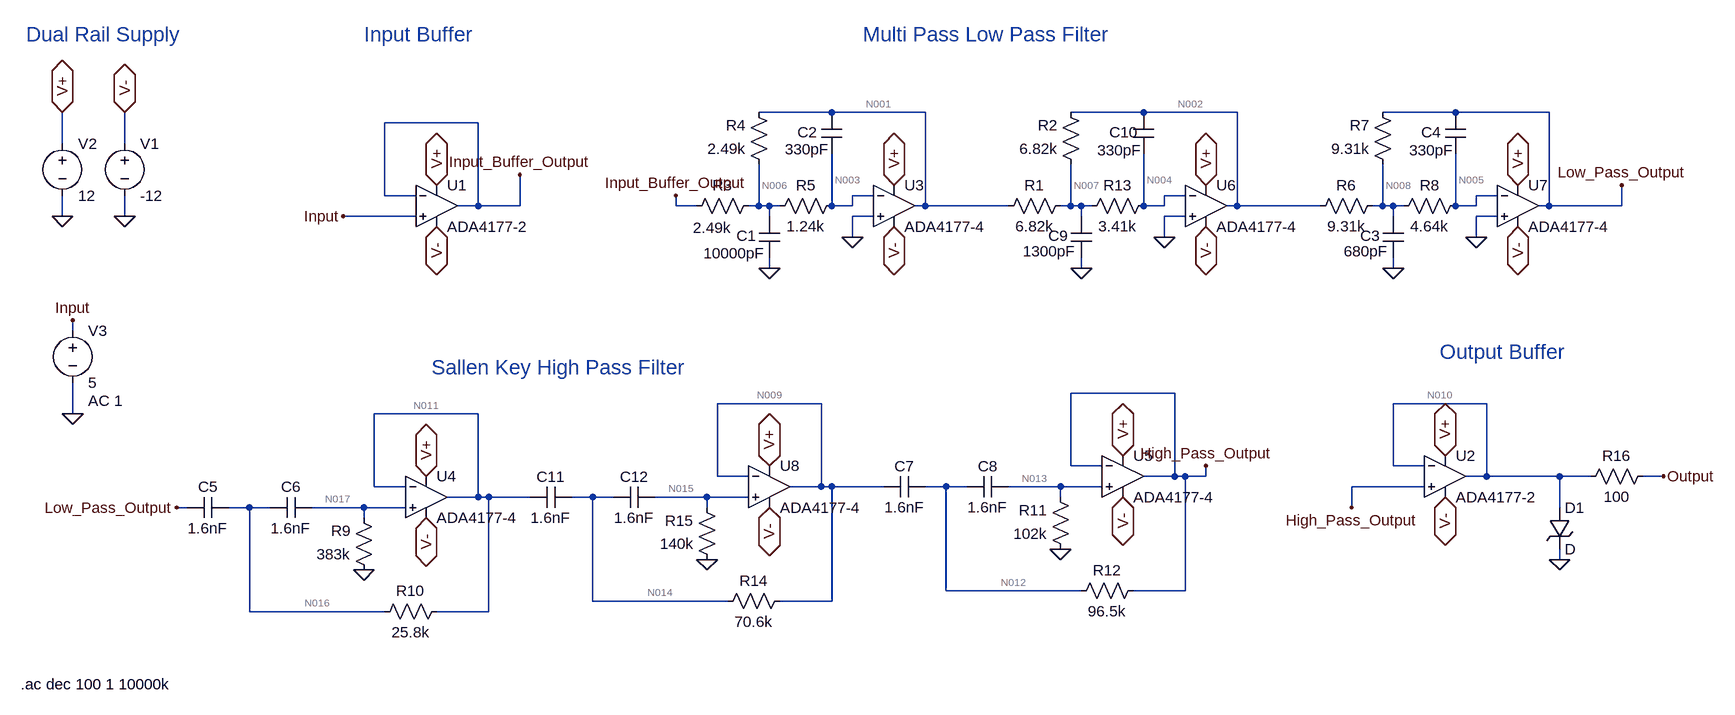
[diagram p0: schematic 8thOrderBandpassFilter.asc]
* 8thOrderBandpassFilter.asc
* U3: ADA4177-4 (symbol OpAmps\ADA4177-4 not available, pins judged from their places): In+=0 In-=N003 V+=V+ V-=V- OUT=N001
* U4: ADA4177-4 (symbol OpAmps\ADA4177-4 not available, pins judged from their places): In+=N017 In-=N011 V+=V+ V-=V- OUT=N011
* U1: ADA4177-2 (symbol OpAmps\ADA4177-2 not available, pins judged from their places): In+=Input In-=Input_Buffer_Output V+=V+ V-=V- OUT=Input_Buffer_Output
* U2: ADA4177-2 (symbol OpAmps\ADA4177-2 not available, pins judged from their places): In+=High_Pass_Output In-=N010 V+=V+ V-=V- OUT=N010
V1 V- 0 -12
V2 V+ 0 12
R3 Input_Buffer_Output N006 2.49k
R4 N006 N001 2.49k
R5 N006 N003 1.24k tol=1 pwr=1/8
C1 0 N006 10000pF
C2 N001 N003 330pF
* U7: ADA4177-4 (symbol OpAmps\ADA4177-4 not available, pins judged from their places): In+=0 In-=N005 V+=V+ V-=V- OUT=Low_Pass_Output
R6 N002 N008 9.31k
R7 N008 Low_Pass_Output 9.31k
R8 N008 N005 4.64k tol=5 pwr=0.166
C3 0 N008 680pF
C4 Low_Pass_Output N005 330pF
R10 N016 N011 25.8k tol=0.1 pwr=1/10
R9 0 N017 383k tol=0.1 pwr=1/10
C5 N016 Low_Pass_Output 1.6nF
C6 N017 N016 1.6nF
* U5: ADA4177-4 (symbol OpAmps\ADA4177-4 not available, pins judged from their places): In+=N013 In-=High_Pass_Output V+=V+ V-=V- OUT=High_Pass_Output
R12 N012 High_Pass_Output 96.5k tol=1 pwr=1/10
R11 0 N013 102k tol=0.5 pwr=1/10
C7 N012 N009 1.6nF
C8 N013 N012 1.6nF
R16 N010 Output 100 tol=1 pwr=1/2
D1 N010 0 D
V3 Input 0 5 AC 1
* U6: ADA4177-4 (symbol OpAmps\ADA4177-4 not available, pins judged from their places): In+=0 In-=N004 V+=V+ V-=V- OUT=N002
R1 N001 N007 6.82k
R2 N007 N002 6.82k
R13 N007 N004 3.41k tol=5 pwr=0.166
C9 0 N007 1300pF
C10 N002 N004 330pF
* U8: ADA4177-4 (symbol OpAmps\ADA4177-4 not available, pins judged from their places): In+=N015 In-=N009 V+=V+ V-=V- OUT=N009
R14 N014 N009 70.6k tol=1 pwr=1/10
R15 0 N015 140k tol=0.5 pwr=1/10
C11 N014 N011 1.6nF
C12 N015 N014 1.6nF
.model D D
.lib standard.dio
* Multi Pass Low Pass Filter
* Input Buffer
* Dual Rail Supply
* Sallen Key High Pass Filter
* Output Buffer
.ac dec 100 1 10000k
.backanno
.end

* Results of the author's LTspice run, read from the files saved beside the schematic
* Operating Point, zero values left out:
*   V(high_pass_output) = 32.6 µV
*   V(input) = 5 V
*   V(input_buffer_output) = 5 V
*   V(low_pass_output) = -5 V
*   V(n001) = -5 V
*   V(n002) = 5 V
*   V(n003) = 11.91 µV
*   V(n004) = -7.025 µV
*   V(n005) = 9.573 µV
*   V(n006) = 11.42 µV
*   V(n007) = -8.395 µV
*   V(n008) = 7.724 µV
*   V(n009) = 43.92 µV
*   V(n010) = 34.26 µV
*   V(n011) = 117.1 µV
*   V(n012) = 32.6 µV
*   V(n013) = 30.94 µV
*   V(n014) = 43.92 µV
*   V(n015) = 42.26 µV
*   V(n016) = 117.1 µV
*   V(n017) = 115.4 µV
*   V(output) = 34.26 µV
*   V(v+) = 12 V
*   V(v-) = -12 V
*   I(R1) = -733.1 µA
*   I(R11) = -300.4 pA
*   I(R13) = -401.8 pA
*   I(R15) = -300.4 pA
*   I(R2) = -733.1 µA
*   I(R3) = 2.008 mA
*   I(R4) = 2.008 mA
*   I(R5) = -397 pA
*   I(R6) = 537.1 µA
*   I(R7) = 537.1 µA
*   I(R8) = -397.6 pA
*   I(R9) = -300.4 pA
*   I(V1) = 4 mA
*   I(V2) = -4 mA
*   I(V3) = 259.9 pA
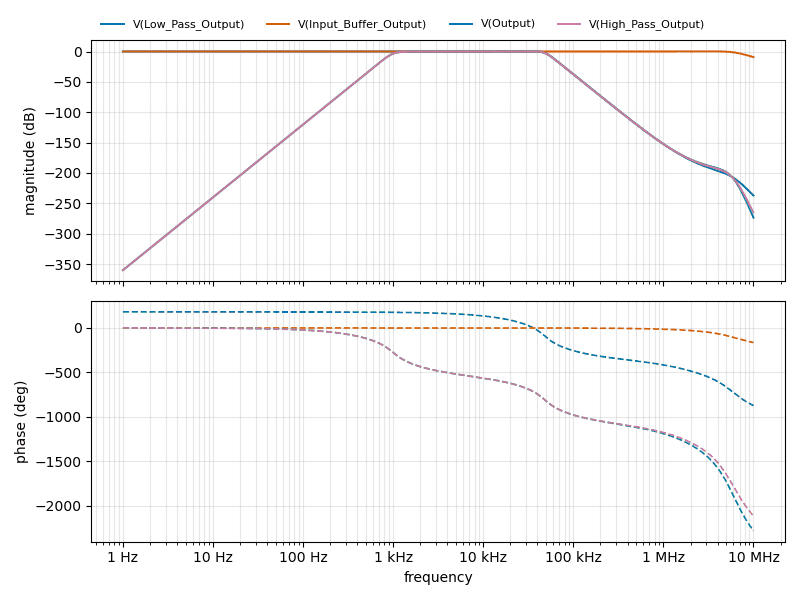
[diagram p1: AC Analysis of 8thOrderBandpassFilter.asc, plotted from the saved traces]
* AC Analysis, 1 run:
*   V(Low_Pass_Output): -0.00 dB at 1 Hz, -237.05 dB at 10 MHz, peak 0.40 dB at 34.67 kHz, 3 dB below the peak at 48.93 kHz
*   V(Input_Buffer_Output): -0.00 dB at 1 Hz, -9.22 dB at 10 MHz, peak 0.31 dB at 3.467 MHz, 3 dB below the peak at 6.792 MHz
*   V(Output): -360.00 dB at 1 Hz, -273.57 dB at 10 MHz, peak 0.13 dB at 34.67 kHz, 3 dB below the peak at 1.022 kHz and 48.93 kHz
*   V(High_Pass_Output): -360.00 dB at 1 Hz, -265.07 dB at 10 MHz, peak 0.13 dB at 34.67 kHz, 3 dB below the peak at 1.022 kHz and 48.93 kHz